# Altium schematic sheet Electronic_Board_Schematic.SchDoc
size A; SheetNumber: 1; SheetTotal: 1
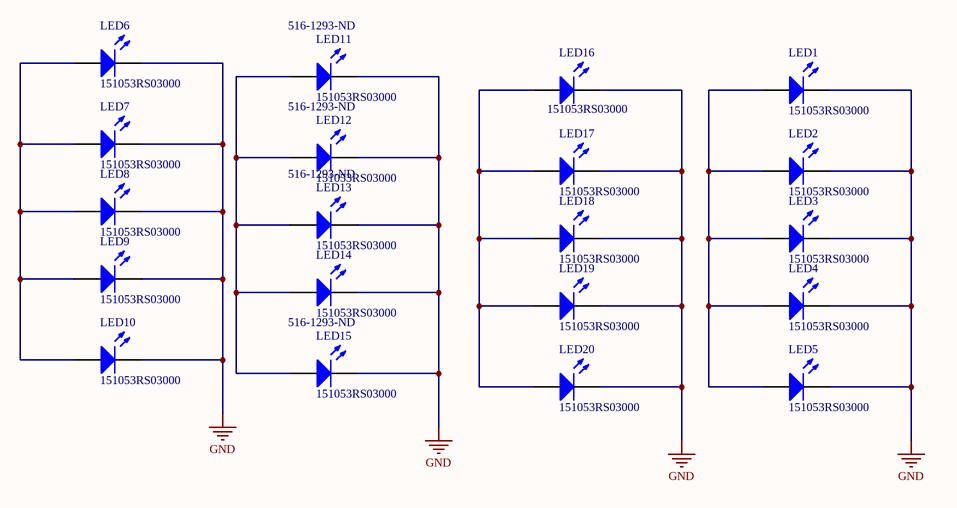
[diagram p0: Electronic_Board_Schematic.SchDoc]

## Parts
LED1  151053RS03000  [Type 5mm]
LED2  151053RS03000  [Type 5mm]
LED3  151053RS03000  [Type 5mm]
LED4  151053RS03000  [Type 5mm]
LED5  151053RS03000  [Type 5mm]
LED6  151053RS03000  [Type 5mm]
LED7  151053RS03000  [Type 5mm]
LED8  151053RS03000  [Type 5mm]
LED9  151053RS03000  [Type 5mm]
LED10  151053RS03000  [Type 5mm]
LED11  151053RS03000  Supplier Part Number 1: 516-1293-ND  [Type 5mm]
LED12  151053RS03000  Supplier Part Number 1: 516-1293-ND  [Type 5mm]
LED13  151053RS03000  Supplier Part Number 1: 516-1293-ND  [Type 5mm]
LED14  151053RS03000  [Type 5mm]
LED15  151053RS03000  Supplier Part Number 1: 516-1293-ND  [Type 5mm]
LED16  151053RS03000  [Type 5mm]
LED17  151053RS03000  [Type 5mm]
LED18  151053RS03000  [Type 5mm]
LED19  151053RS03000  [Type 5mm]
LED20  151053RS03000  [Type 5mm]

## Nets
GND: LED1.1(K) LED2.1(K) LED3.1(K) LED4.1(K) LED5.1(K) LED6.1(K) LED7.1(K) LED8.1(K) LED9.1(K) LED10.1(K) LED11.1(K) LED12.1(K) LED13.1(K) LED14.1(K) LED15.1(K) LED16.1(K) LED17.1(K) LED18.1(K) LED19.1(K) LED20.1(K)
NetLED1_2: LED1.2(A) LED2.2(A) LED3.2(A) LED4.2(A) LED5.2(A)
NetLED6_2: LED6.2(A) LED7.2(A) LED8.2(A) LED9.2(A) LED10.2(A)
NetLED11_2: LED11.2(A) LED12.2(A) LED13.2(A) LED14.2(A) LED15.2(A)
NetLED16_2: LED16.2(A) LED17.2(A) LED18.2(A) LED19.2(A) LED20.2(A)

## Library data of the parts
LED1-LED10 LED14 LED16-LED20 = CMP-1489-00007-1: THT LED round mono-color waterclear,  WL-TMRW ,Red; Manufacturer: Wuerth Elektronik; PackageReference: Type 5mm; PartNumber: 151053RS03000; ComponentLink1URL: http://www.we-online.com; ComponentLink2Description: Datasheet; Emitting color: Red; ComponentLink2URL: http://katalog.we-online.de/pbs/datasheet/7448042001.pdfhttp://katalog.we-online.de/pbs/datasheet/7448042001.pdfhttp://katalog.we-online.de/pbs/datasheet/7448042001.pdfhttp://katalog.we-online.de/pbs/datasheet/151053RS03000.pdf; ComponentLink1Description: Manufacturer URL
LED11-LED13 LED15 = CMP-1489-00007-1: THT LED round mono-color waterclear,  WL-TMRW ,Red; Manufacturer: Wuerth Elektronik; Color: Green; Wavelength: 569nm; Luminous Intensity: 1mcd; Forward Voltage: 2.1V; Forward Current: 30mA; Lens Style: Dome,Diffused,Colored,Circular,Round; Viewing Angle: 60°; Test Current: 10mA; Number of Elements: 1; Reverse Voltage: 5V; Lens Transparency: Diffused; Lens Size: 3mm; Lead Length: 25.4mm; PackageReference: Type 5mm; PartNumber: 151053RS03000; ComponentLink1URL: http://www.we-online.com; ComponentLink2Description: Datasheet; Emitting color: Red; ComponentLink2URL: http://katalog.we-online.de/pbs/datasheet/7448042001.pdfhttp://katalog.we-online.de/pbs/datasheet/7448042001.pdfhttp://katalog.we-online.de/pbs/datasheet/7448042001.pdfhttp://katalog.we-online.de/pbs/datasheet/151053RS03000.pdf; ComponentLink1Description: Manufacturer URL; Supplier 1: Digi-Key; Manufacturer Part Number: HLMP-1503; RoHS: Yes; Category: LEDs; Stock 1: 88920; Pricing 1: 1=0.48000, 10=0.29800, 100=0.17110, 1000=0.13394, 2000=0.12278, 5000=0.11162, 10000=0.10530 (USD); Mount: Through Hole; Case/Package: T; Number of Pins: 2; Lens Color: Green; Min Operating Temperature: -20°C; Max Operating Temperature: 100°C; Package Quantity: 2000; Dominant Wavelength: 569nm; Packaging: Bulk; Illumination Color: Green; Series: -; Number of LEDs: 1; Voltage Rating: 5V; Min Supply Voltage: 2.1V; Diameter: 3mm; Length: 3.43mm; Height: 6.35mm; Depth: 3.43mm; Radiation Hardening: No; RoHS Compliant: Yes; REACH SVHC: No SVHC; Lead Free: Lead Free; ComponentLink3URL: https://datasheet.ciiva.com/11775/0900766b80026841-11775015.pdf?src-supplier=RSComponents; ComponentLink3Description: https://datasheet.ciiva.com/11775/0900766b80026841-11775015.pdf?src-supplier=RSComponents; ComponentLink4URL: https://datasheet.ciiva.com/15117/getdatasheetpartid-117200-15117575.pdf?src-supplier=Verical; ComponentLink4Description: https://datasheet.ciiva.com/15117/getdatasheetpartid-117200-15117575.pdf?src-supplier=Verical; ComponentLink5URL: https://datasheet.ciiva.com/11773/0900766b800a3de2-11773965.pdf?src-supplier=RSComponents; ComponentLink5Description: https://datasheet.ciiva.com/11773/0900766b800a3de2-11773965.pdf?src-supplier=RSComponents; ComponentLink6URL: https://datasheet.ciiva.com/29334/180612-da-01-en-led-3mm-hlmp-1503-gruen-29334880.pdf?src-supplier=Conrad; ComponentLink6Description: https://datasheet.ciiva.com/29334/180612-da-01-en-led-3mm-hlmp-1503-gruen-29334880.pdf?src-supplier=Conrad; ComponentLink7URL: https://datasheet.ciiva.com/14604/70157734-14604090.pdf?src-supplier=Allied+Electronics; ComponentLink7Description: https://datasheet.ciiva.com/14604/70157734-14604090.pdf?src-supplier=Allied+Electronics